# EAGLE design usb2cmi_mini_disp (EAGLE 6.5.0)
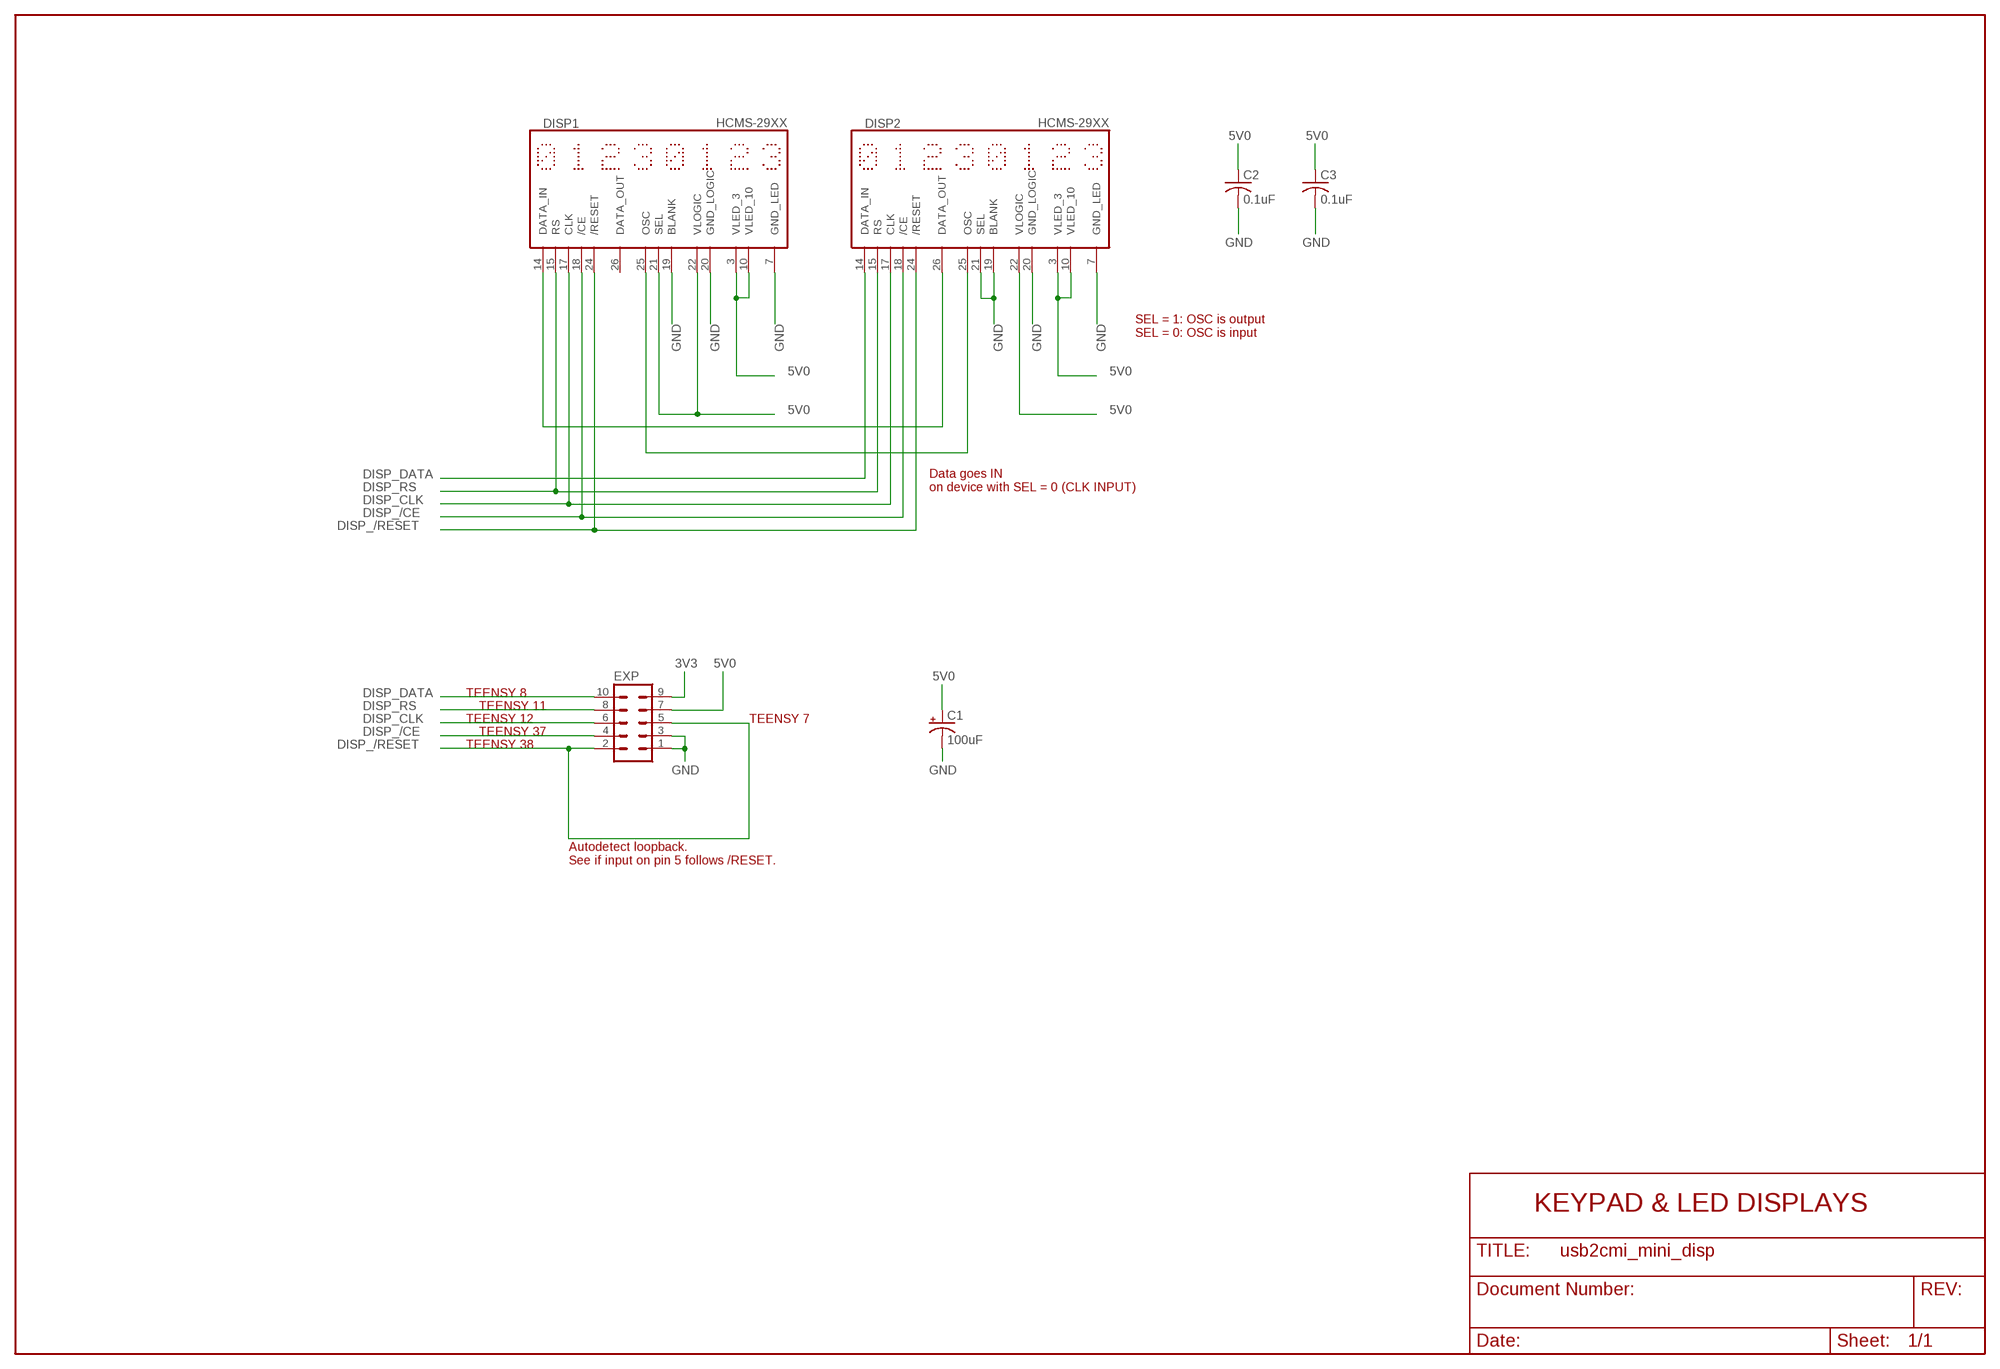
[diagram p0: schematic, sheet 1]

## Parts
C1  100uF  CPOL-USE2.5-7  [E2,5-7]
C2  0.1uF  C-US050-025X075  [C050-025X075]
C3  0.1uF  C-US050-025X075  [C050-025X075]
DISP1  HCMS-29XX  [HCMS-29XX]
DISP2  HCMS-29XX  [HCMS-29XX]
EXP  MA05-2  [MA05-2]

## Nets
3V3: EXP.9
5V0: C1.+ C2.1 C3.1 DISP1.3(VLED_3) DISP1.10(VLED_10) DISP1.21(SEL) DISP1.22(VLOGIC) DISP2.3(VLED_3) DISP2.10(VLED_10) DISP2.22(VLOGIC) EXP.7
DISP_/CE: DISP1.18(/CE) DISP2.18(/CE) EXP.4
DISP_/RESET: DISP1.24(/RESET) DISP2.24(/RESET) EXP.2 EXP.5
DISP_CLK: DISP1.17(CLK) DISP2.17(CLK) EXP.6
DISP_DATA: DISP2.14(DATA_IN) EXP.10
DISP_RS: DISP1.15(RS) DISP2.15(RS) EXP.8
GND: C1.- C2.2 C3.2 DISP1.7(GND_LED) DISP1.19(BLANK) DISP1.20(GND_LOGIC) DISP2.7(GND_LED) DISP2.19(BLANK) DISP2.20(GND_LOGIC) DISP2.21(SEL) EXP.1 EXP.3
N$1: DISP1.14(DATA_IN) DISP2.26(DATA_OUT)
N$3: DISP1.25(OSC) DISP2.25(OSC)
Unconnected: DISP1.26(DATA_OUT)

## Notes on the sheet
- SEL = 1: OSC is output
  SEL = 0: OSC is input
- Data goes IN
  on device with SEL = 0 (CLK INPUT)
- TEENSY 8
- TEENSY 11
- TEENSY 12 | TEENSY 7
- TEENSY 37
- TEENSY 38
- Autodetect loopback.
  See if input on pin 5 follows /RESET.
- KEYPAD & LED DISPLAYS

## Library data of the parts
C1 = rcl:CPOL-US: POLARIZED CAPACITOR, American symbol
C2 C3 = rcl:C-US: CAPACITOR, American symbol
DISP1 DISP2 = disp-avago:HCMS-29XX
EXP = con-lstb:MA05-2: PIN HEADER; OC_FARNELL: unknown; OC_NEWARK: unknown

## Board
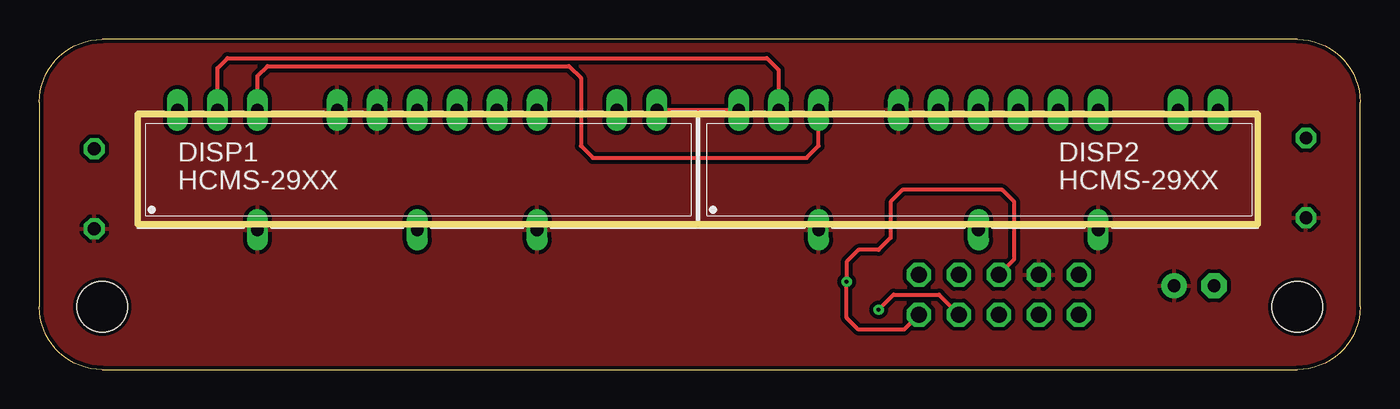
[diagram p1: board, top side]
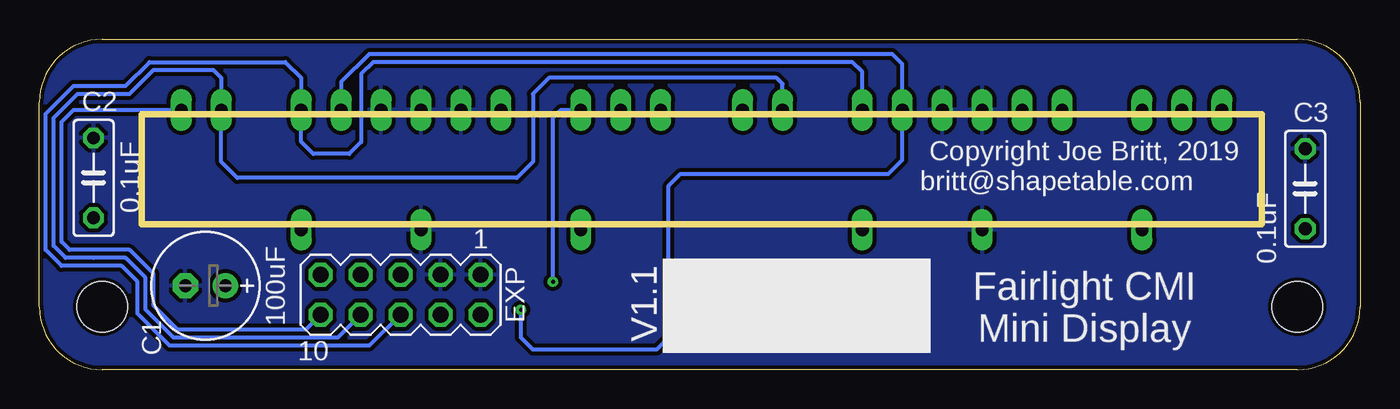
[diagram p2: board, bottom side, seen from below]

Size 84 x 21 mm. Coordinates in mm from the lower left corner, seen from the top.
Outline: 4,0 80,0 arc90 84,4 84,17 arc90 80,21 4,21 arc90 0,17 0,4 arc90 4,0
Copper layers (1*16): Top 0.035mm / dielectric 1.5mm / Bottom 0.035mm
Design rules "default *": minimum track width 6mil, minimum drill 10mil, track to track 6mil, track to pad 6mil, pad to pad 6mil, via to via 6mil, smd to smd 6mil, copper to edge 6mil, drill to drill 6mil, minimum pad ring 10mil, minimum via ring 8mil, stop-mask expansion 4mil, vias tented up to drill 10mil, thermal gap 10mil
Holes 3.2 mm at 80,4 4,4
Milling: 4 lines

### Footprints (pad centres in the part's own frame; a part is rotated, then mirrored left to right if it is on the bottom)
E2,5-7 = drill 0.813 pad 1.6: + -1.27,0 | drill 0.813 pad 1.6 octagon: - 1.27,0
C050-025X075 = drill 0.813 octagon: 1 -2.54,0; 2 2.54,0
HCMS-29XX = drill 0.813 long: 3 -10.16,-3.81; 7 0,-3.81; 10 7.62,-3.81; 14 15.24,3.81; 15 12.7,3.81; 17 7.62,3.81; 18 5.08,3.81; 19 2.54,3.81; 20 0,3.81; 21 -2.54,3.81; 22 -5.08,3.81; 24 -10.16,3.81; 25 -12.7,3.81; 26 -15.24,3.81
MA05-2 = drill 1.016 octagon: 1 -5.08,-1.27; 2 -5.08,1.27; 3 -2.54,-1.27; 4 -2.54,1.27; 5 0,-1.27; 6 0,1.27; 7 2.54,-1.27; 8 2.54,1.27; 9 5.08,-1.27; 10 5.08,1.27

### Placement (x,y rotation side)
C1  73.44,5.33 180 bottom
C2  80.55,12.19 90 bottom
C3  3.5,11.5 90 bottom
DISP1  24.04,12.7 0 top
DISP2  59.72,12.7 0 top
EXP  61.02,4.76 180 bottom

### Tracks (layer width: path | path; a pad name or v marks a point on that pad's centre or on a via)
5V0
  pour Top (isolate 0.254): -2,25 86,25 86,0 -2,0
DISP_/CE  (via drill 0.25)
  Top 0.254: v53.37,3.81 54.33,4.76 57.21,4.76 EXP.4
  Bottom 0.254: DISP2.18 64.8,18.29 63.02,20.07 29.75,20.07 29.11,19.43 DISP1.18 29.11,13.34 30,12.45 43.21,12.45 43.97,11.68 43.97,2.03 44.74,1.27 52.61,1.27 53.37,2.03 v53.37,3.81
DISP_/RESET  (via drill 0.25)
  Top 0.254: DISP1.24 13.88,18.67 14.51,19.3 33.69,19.3 34.45,18.54 34.45,14.22 35.21,13.46 48.8,13.46 49.56,14.22 DISP2.24 | EXP.2 54.99,2.54 52.1,2.54 51.34,3.3 v51.34,5.59 51.34,6.86 52.1,7.62 53.37,7.62 54.13,8.38 54.13,10.67 54.9,11.43 61.25,11.43 62.01,10.67 62.01,7.02 EXP.5
  Bottom 0.254: v51.34,5.59 51.34,16 50.83,16.51 DISP2.24
DISP_CLK
  Bottom 0.254: DISP1.17 31.66,18.92 32.29,19.56 62.77,19.56 63.53,18.8 63.53,14.48 64.29,13.72 66.58,13.72 67.34,14.48 DISP2.17 67.34,18.54 68.36,19.56 76.99,19.56 78.52,18.03 81.82,18.03 83.6,16.26 83.6,7.62 82.58,6.6 78.77,6.6 77.76,5.59 77.76,3.56 75.72,1.52 63.02,1.52 EXP.6
DISP_DATA
  Bottom 0.254: EXP.10 67.05,2.54 75.22,2.54 76.74,4.06 76.74,6.1 78.26,7.62 82.07,7.62 82.58,8.13 82.58,15.75 81.82,16.51 DISP2.14
DISP_RS
  Bottom 0.254: DISP1.15 36.73,18.16 37.12,18.54 51.59,18.54 52.61,17.53 52.61,13.21 53.63,12.19 71.41,12.19 72.42,13.21 DISP2.15 72.42,18.54 72.93,19.05 76.74,19.05 78.26,17.53 81.57,17.53 83.09,16 83.09,7.87 82.33,7.11 80.55,7.11 78.52,7.11 77.25,5.84 77.25,3.81 75.47,2.03 65.02,2.03 EXP.8
GND
  pour Bottom (isolate 0.254): -2,25 86,25 86,0 -2,0
N$1
  Top 0.254: DISP1.14 DISP2.26
N$3
  Top 0.254: DISP1.25 11.34,19.18 11.97,19.81 46.26,19.81 47.02,19.05 DISP2.25

### Text on the board
bPlace: Copyright Joe Britt, 2019 | britt@shapetable.com | V1.1 | Fairlight CMI / Mini Display